# EAGLE schematic 3ch mix 1.3 version 2 (EAGLE 6.5.0)
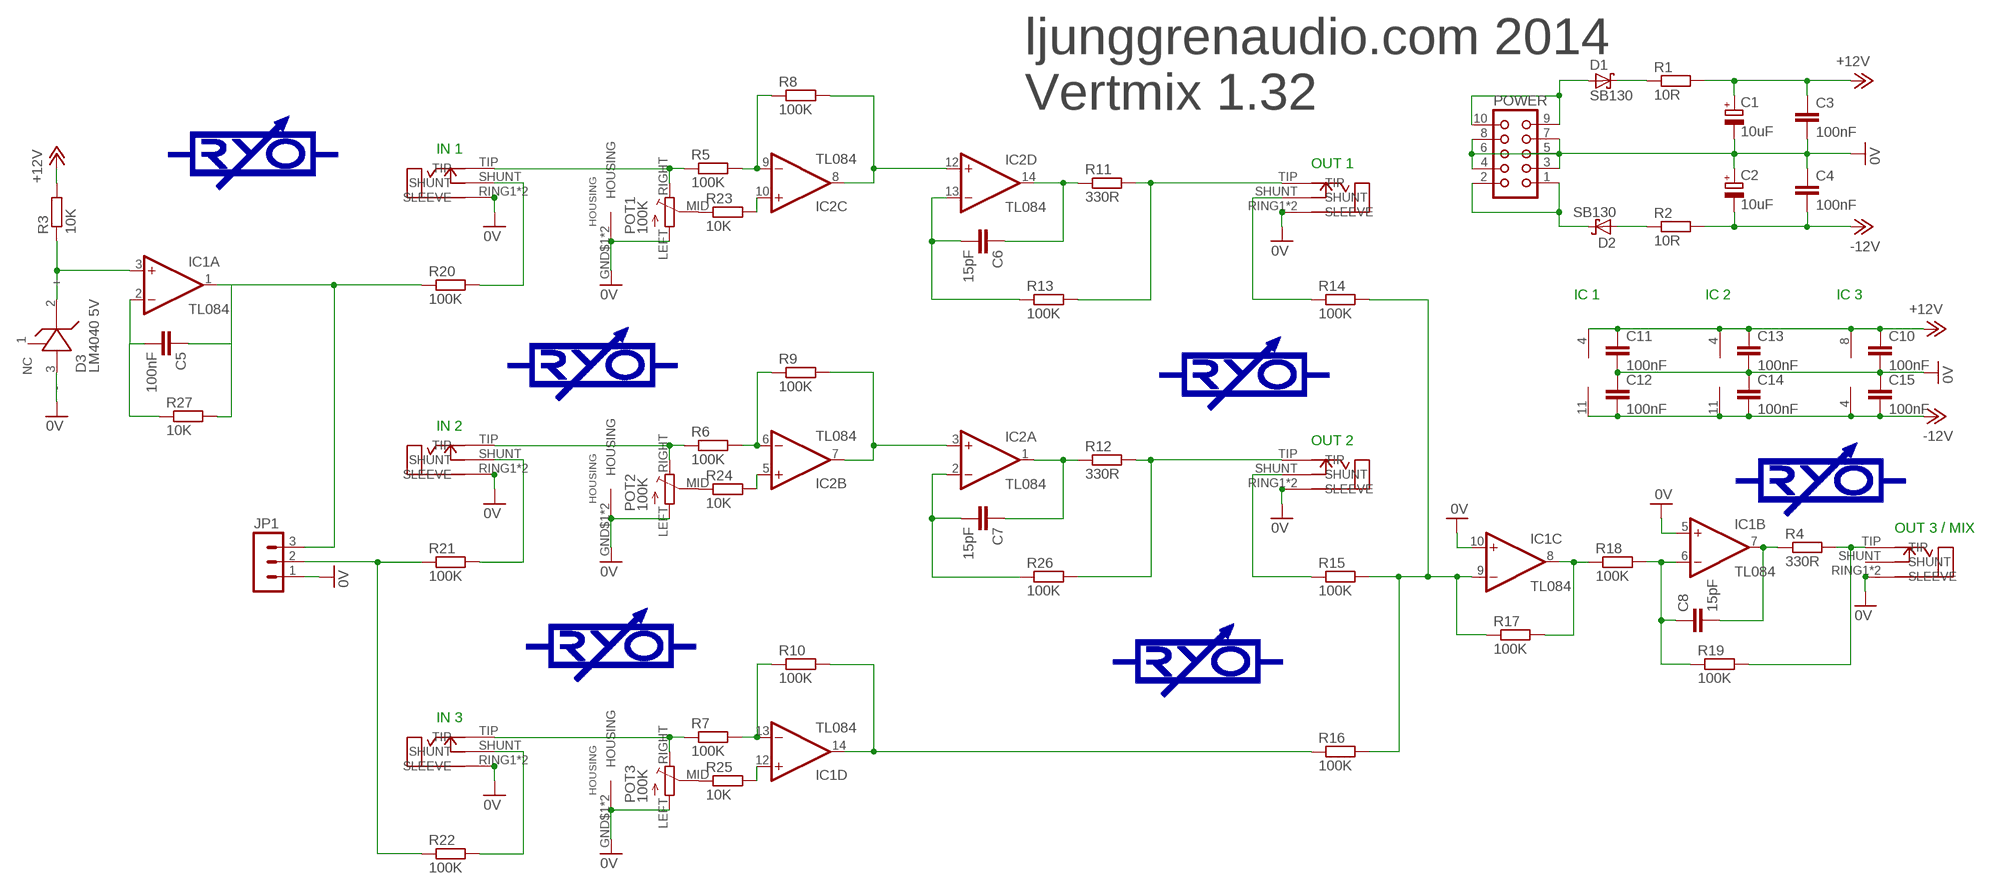
[diagram p0: schematic, sheet 1]

## Parts
C1  10uF  CPOL-EUE2-5  [E2-5]
C2  10uF  CPOL-EUE2-5  [E2-5]
C3  100nF  C-EU025-024X044  [C025-024X044]
C4  100nF  C-EU025-024X044  [C025-024X044]
C5  100nF  C-EU025-024X044  [C025-024X044]
C6  15pF  C-EU025-024X044  [C025-024X044]
C7  15pF  C-EU025-024X044  [C025-024X044]
C8  15pF  C-EU025-024X044  [C025-024X044]
C10  100nF  C-EU025-024X044  [C025-024X044]
C11  100nF  C-EU025-024X044  [C025-024X044]
C12  100nF  C-EU025-024X044  [C025-024X044]
C13  100nF  C-EU025-024X044  [C025-024X044]
C14  100nF  C-EU025-024X044  [C025-024X044]
C15  100nF  C-EU025-024X044  [C025-024X044]
D1  SB130  SB130DO-204AL  [DO41-7]
D2  SB130  SB130DO-204AL  [DO41-7]
D3  LM4040 5V  LM4040  [TO92-LINE]
IC1  TL084  TL074P  [DIL14]
IC2  TL084  TL074P  [DIL14]
IC3  TL072P  [DIL08]
IN1  ERTHENVAR_3.5MM_JACK  [ERTHENVAR]
IN2  ERTHENVAR_3.5MM_JACK  [ERTHENVAR]
IN3  ERTHENVAR_3.5MM_JACK  [ERTHENVAR]
JP1  MA03-1  [MA03-1]
OUT1  ERTHENVAR_3.5MM_JACK  [ERTHENVAR]
OUT2  ERTHENVAR_3.5MM_JACK  [ERTHENVAR]
OUT3  ERTHENVAR_3.5MM_JACK  [ERTHENVAR]
POT1  100K  POT-ALPHA9  [POT-ALPHA9]
POT2  100K  POT-ALPHA9  [POT-ALPHA9]
POT3  100K  POT-ALPHA9  [POT-ALPHA9]
POWER  CON10L  [CON10L]
R1  10R  R-EU_0207/10  [0207/9]
R2  10R  R-EU_0207/10  [0207/9]
R3  10K  R-EU_0204/5  [0204/5]
R4  330R  R-EU_0204/5  [0204/5]
R5  100K  R-EU_0204/5  [0204/5]
R6  100K  R-EU_0204/5  [0204/5]
R7  100K  R-EU_0204/5  [0204/5]
R8  100K  R-EU_0204/5  [0204/5]
R9  100K  R-EU_0204/5  [0204/5]
R10  100K  R-EU_0204/5  [0204/5]
R11  330R  R-EU_0204/5  [0204/5]
R12  330R  R-EU_0204/5  [0204/5]
R13  100K  R-EU_0204/5  [0204/5]
R14  100K  R-EU_0204/5  [0204/5]
R15  100K  R-EU_0204/5  [0204/5]
R16  100K  R-EU_0204/5  [0204/5]
R17  100K  R-EU_0204/5  [0204/5]
R18  100K  R-EU_0204/5  [0204/5]
R19  100K  R-EU_0204/5  [0204/5]
R20  100K  R-EU_0204/5  [0204/5]
R21  100K  R-EU_0204/5  [0204/5]
R22  100K  R-EU_0204/5  [0204/5]
R23  10K  R-EU_0204/5  [0204/5]
R24  10K  R-EU_0204/5  [0204/5]
R25  10K  R-EU_0204/5  [0204/5]
R26  100K  R-EU_0204/5  [0204/5]
R27  10K  R-EU_0204/5  [0204/5]

## Nets
0V: C1.- C2.+ C3.2 C4.1 C10.2 C11.2 C12.1 C13.2 C14.1 C15.1 D3.3(-) IC1.5(B:+IN) IC1.10(C:+IN) IN1.RING1(SLEEVE) IN1.RING2(SLEEVE) IN2.RING1(SLEEVE) IN2.RING2(SLEEVE) IN3.RING1(SLEEVE) IN3.RING2(SLEEVE) JP1.1 OUT1.RING1(SLEEVE) OUT1.RING2(SLEEVE) OUT2.RING1(SLEEVE) OUT2.RING2(SLEEVE) OUT3.RING1(SLEEVE) OUT3.RING2(SLEEVE) POT1.GND$1(HOUSING) POT1.GND$2(HOUSING) POT1.LEFT POT2.GND$1(HOUSING) POT2.GND$2(HOUSING) POT2.LEFT POT3.GND$1(HOUSING) POT3.GND$2(HOUSING) POT3.LEFT POWER.3 POWER.4 POWER.5 POWER.6 POWER.7 POWER.8
+12V: C1.+ C3.1 C10.1 C11.1 C13.1 IC1.4(P:V+) IC2.4(P:V+) IC3.8(P:V+) R1.2 R3.2
-12V: C2.- C4.2 C12.2 C14.2 C15.2 IC1.11(P:V-) IC2.11(P:V-) IC3.4(P:V-) R2.2
N$1: D1.A POWER.9 POWER.10
N$2: D2.C POWER.1 POWER.2
N$3: IC1.8(C:OUT) R17.2 R18.1
N$4: C8.1 IC1.6(B:-IN) R18.2 R19.1
N$5: D1.C R1.1
N$6: D2.A R2.1
N$7: C5.1 IC1.1(A:OUT) JP1.3 R20.1 R27.2
N$8: IC2.8(C:OUT) IC2.12(D:+IN) R8.2
N$9: IN2.TIP POT2.RIGHT R6.1
N$10: D3.2(+) IC1.3(A:+IN) R3.1
N$11: POT1.MID R23.1
N$12: IN1.TIP POT1.RIGHT R5.1
N$13: POT2.MID R24.1
N$14: IN3.TIP POT3.RIGHT R7.1
N$15: IC2.9(C:-IN) R5.2 R8.1
N$16: IC2.10(C:+IN) R23.2
N$17: IC2.5(B:+IN) R24.2
N$18: IC1.12(D:+IN) R25.2
N$19: IC2.3(A:+IN) IC2.7(B:OUT) R9.2
N$20: POT3.MID R25.1
N$21: IC2.6(B:-IN) R6.2 R9.1
N$22: IC1.13(D:-IN) R7.2 R10.1
N$23: OUT3.TIP R4.2 R19.2
N$25: IC1.14(D:OUT) R10.2 R16.1
N$26: OUT1.SHUNT R14.1
N$27: OUT2.SHUNT R15.1
N$28: IC1.9(C:-IN) R14.2 R15.2 R16.2 R17.1
N$29: C8.2 IC1.7(B:OUT) R4.1
N$30: IN1.SHUNT R20.2
N$31: IN2.SHUNT R21.2
N$32: IN3.SHUNT R22.2
N$33: JP1.2 R21.1 R22.1
N$34: C5.2 IC1.2(A:-IN) R27.1
N$35: C6.2 IC2.13(D:-IN) R13.1
N$36: OUT1.TIP R11.2 R13.2
N$37: C6.1 IC2.14(D:OUT) R11.1
N$38: C7.1 IC2.1(A:OUT) R12.1
N$39: OUT2.TIP R12.2 R26.2
N$40: C7.2 IC2.2(A:-IN) R26.1
Unconnected: D3.1(NC) IC3.1(A:OUT) IC3.2(A:-IN) IC3.3(A:+IN) IC3.5(B:+IN) IC3.6(B:-IN) IC3.7(B:OUT) OUT3.SHUNT

## Notes on the sheet
- ljunggrenaudio.com 2014
  Vertmix 1.32
- IN 1
- OUT 1
- HOUSING
- IC 1 | IC 2 | IC 3
- IN 2
- OUT 2
- HOUSING
- OUT 3 / MIX
- IN 3
- HOUSING

## Library data of the parts
C1 C2 = Roll Your Own:CPOL-EU: POLARIZED CAPACITOR, European symbol
C3-C8 C10-C15 = Roll Your Own:C-EU: CAPACITOR, European symbol
D1 D2 = Roll Your Own:SB130
D3 = Roll Your Own:LM4040
IC1 IC2 = Roll Your Own:TL074: OP AMP
IC3 = Roll Your Own:TL072: OP AMP
IN1-IN3 OUT1-OUT3 = Roll Your Own:ERTHENVAR_3.5MM_JACK
JP1 = Roll Your Own:MA03-1: PIN HEADER; OC_FARNELL: unknown; OC_NEWARK: unknown
POT1-POT3 = Roll Your Own:POT-ALPHA9
POWER = Roll Your Own:CON10L: CONNECTOR; OC_FARNELL: unknown; OC_NEWARK: unknown
R1-R27 = Roll Your Own:R-EU_: RESISTOR, European symbol